# EAGLE schematic GBxCart_RW_v1.0_Schematic (EAGLE 6.4)
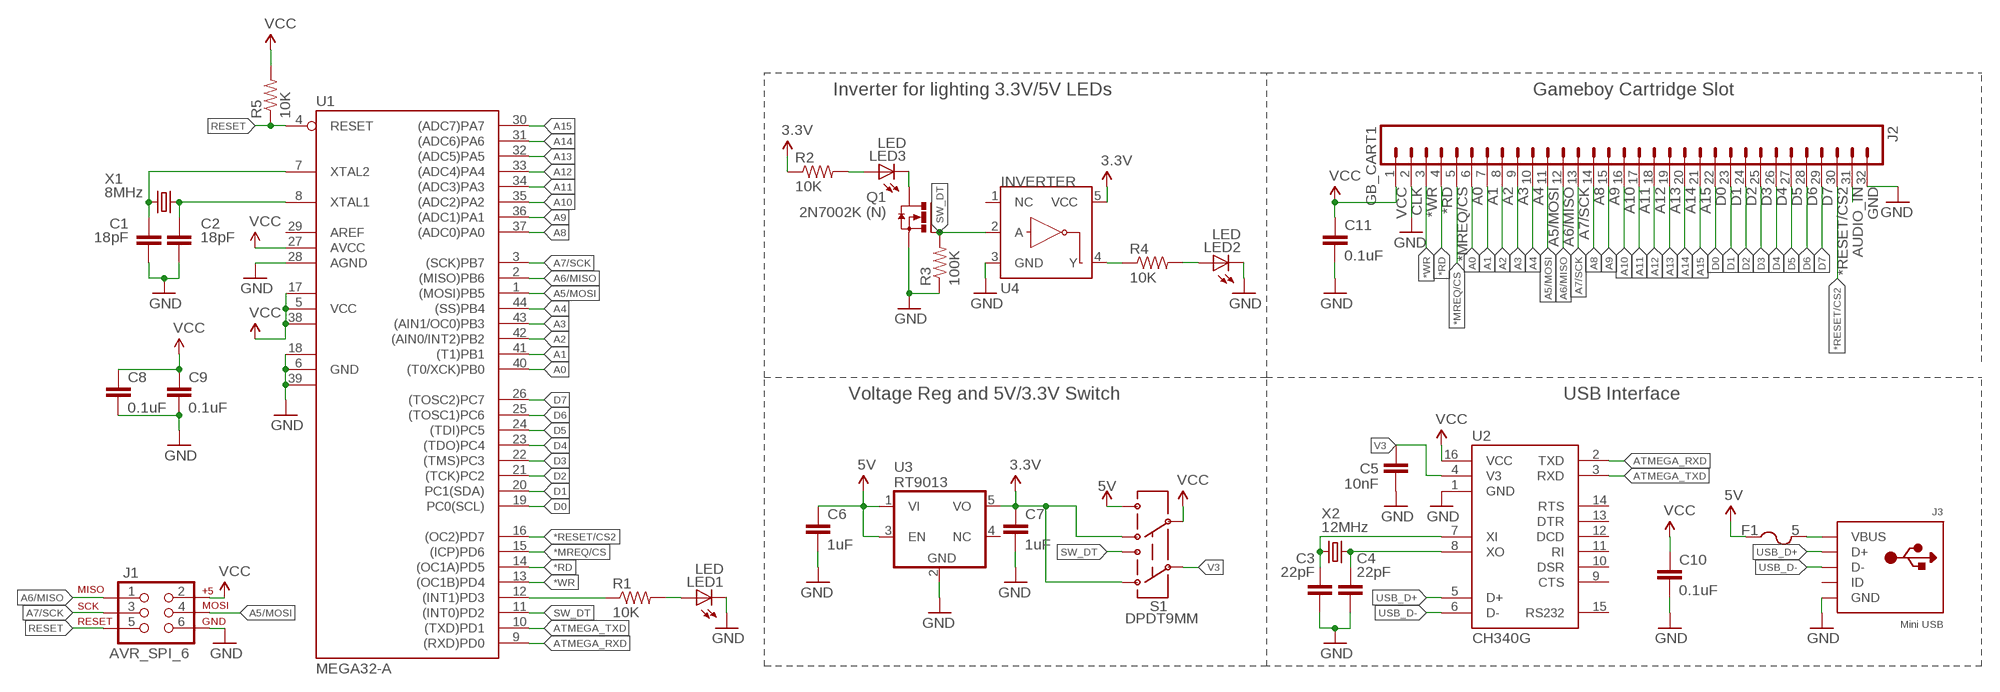
[diagram p0: schematic, sheet 1]

## Parts
C1  18pF  CAP0805  [C0805K]
C2  18pF  CAP0805  [C0805K]
C3  22pF  CAP0805  [C0805K]
C4  22pF  CAP0805  [C0805K]
C5  10nF  CAP0805  [C0805K]
C6  1uF  CAP0805  [C0805K]
C7  1uF  CAP0805  [C0805K]
C8  0.1uF  CAP0805  [C0805K]
C9  0.1uF  CAP0805  [C0805K]
C10  0.1uF  CAP0805  [C0805K]
C11  0.1uF  CAP0805  [C0805K]
F1  5  PTCFUSE-1206  [R1206]
J1  AVR_SPI_6  AVR_SPI_PRG_6  [2X3_2]
J2  GB_CART1  [GB_CART_1]
J3  Mini USB  USBMINIB  [USB-MINIB]
LED1  LED  LEDCHIP-LED0805  [CHIP-LED0805]
LED2  LED  LEDCHIP-LED0805  [CHIP-LED0805]
LED3  LED  LEDCHIP-LED0805  [CHIP-LED0805]
Q1  2N7002K (N)  2N7002K_(N)SOT-23  [SOT-23]
R1  10K  R-US_R0805_2  [R0805_2]
R2  10K  R-US_R0805_2  [R0805_2]
R3  100K  R-US_R0805_2  [R0805_2]
R4  10K  R-US_R0805_2  [R0805_2]
R5  10K  R-US_R0805_2  [R0805_2]
S1  DPDT9MM  SWITCH-DPDT9MM-DIP  [DPDT-3]
U1  MEGA32-A  [TQFP44]
U2  CH340G  [SO16]
U3  RT9013  [SOT23-5L]
U4  INVERTER  [SOT23-5]
X1  8MHz  CRYSTALHC49U-V  [HC49U-V]
X2  12MHz  CRYSTALHC49U-V  [HC49U-V]

## Nets
3.3V: C7.1 R2.1 S1.1 S1.4 U3.5(VO) U4.5(VCC)
5V: C6.1 F1.1 S1.6 U3.1(VI) U3.3(EN)
*MREQ/CS: J2.5 U1.15((ICP)PD6)
*RD: J2.4 U1.14((OC1A)PD5)
*RESET/CS2: J2.30 U1.16((OC2)PD7)
*WR: J2.3 U1.13((OC1B)PD4)
A0: J2.6 U1.40((T0/XCK)PB0)
A1: J2.7 U1.41((T1)PB1)
A2: J2.8 U1.42((AIN0/INT2)PB2)
A3: J2.9 U1.43((AIN1/OC0)PB3)
A4: J2.10 U1.44((SS)PB4)
A5/MOSI: J1.4 J2.11 U1.1((MOSI)PB5)
A6/MISO: J1.1 J2.12 U1.2((MISO)PB6)
A7/SCK: J1.3 J2.13 U1.3((SCK)PB7)
A8: J2.14 U1.37((ADC0)PA0)
A9: J2.15 U1.36((ADC1)PA1)
A10: J2.16 U1.35((ADC2)PA2)
A11: J2.17 U1.34((ADC3)PA3)
A12: J2.18 U1.33((ADC4)PA4)
A13: J2.19 U1.32((ADC5)PA5)
A14: J2.20 U1.31((ADC6)PA6)
A15: J2.21 U1.30((ADC7)PA7)
ATMEGA_RXD: U1.9((RXD)PD0) U2.2(TXD)
ATMEGA_TXD: U1.10((TXD)PD1) U2.3(RXD)
AUDIO_IN: J2.31
D0: J2.22 U1.19(PC0(SCL))
D1: J2.23 U1.20(PC1(SDA))
D2: J2.24 U1.21((TCK)PC2)
D3: J2.25 U1.22((TMS)PC3)
D4: J2.26 U1.23((TDO)PC4)
D5: J2.27 U1.24((TDI)PC5)
D6: J2.28 U1.25((TOSC1)PC6)
D7: J2.29 U1.26((TOSC2)PC7)
GND: C1.2 C2.2 C3.2 C4.2 C5.2 C6.2 C7.2 C8.2 C9.2 C10.2 C11.2 J1.6 J2.2 J2.32 J3.GND LED1.C LED2.C Q1.2(S) R3.1 U1.6(GND) U1.18(GND1) U1.28(AGND) U1.39(GND2) U2.1(GND) U3.2(GND) U4.3(GND)
N$1: R1.1 U1.12((INT1)PD3)
N$2: LED2.A R4.2
N$4: R4.1 U4.4(Y)
N$5: LED3.A R2.2
N$6: LED3.C Q1.3(D)
N$7: F1.2 J3.VBUS
N$18: LED1.A R1.2
RESET: J1.5 R5.1 U1.4(RESET)
SW_DT: Q1.1(G) R3.2 S1.3 U1.11((INT0)PD2) U4.2(A)
USB_D+: J3.D+ U2.5(D+)
USB_D-: J3.D- U2.6(D-)
V3: C5.1 S1.2 U2.4(V3)
VCC: C8.1 C9.1 C10.1 C11.1 J1.2 J2.1 R5.2 S1.5 U1.5(VCC) U1.17(VCC1) U1.27(AVCC) U1.38(VCC2) U2.16(VCC)
XTAL3: C3.1 U2.7(XI) X2.2
XTAL4: C4.1 U2.8(XO) X2.1
XTAL5: C1.1 U1.7(XTAL2) X1.2
XTAL6: C2.1 U1.8(XTAL1) X1.1
Unconnected: J3.ID U2.9(CTS) U2.10(DSR) U2.11(RI) U2.12(DCD) U2.13(DTR) U2.14(RTS) U2.15(RS232) U3.4(NC) U4.1(NC)

## Notes on the sheet
- Inverter for lighting 3.3V/5V LEDs | Gameboy Cartridge Slot
- VCC | CLK
- Voltage Reg and 5V/3.3V Switch | USB Interface

## Power pins joined to a net without a drawn wire
AREF: U1.29(AREF)

## Library data of the parts
C1-C11 = adafruit:CAP
F1 = adafruit:PTCFUSE: PTC fuses, resettable thermistors
J1 = SparkFun:AVR_SPI_PRG_6: AVR ISP 6 Pin This is the reduced ISP connector for AVR programming. Common on Arduino. This footprint will take up less PCB space and can be used with a 10-pin to 6-pin adapter such as SKU: BOB-08508
J2 = alex:GB_CART
J3 = adafruit:USB: USB Connectors USBMINIB - Surface Mount Female Mini-B USB Connector 4UConnector: 06564 By microbuilder.eu Thru-hole RA Female Mini-B USB Connector 4UConnector: 18732 By ladyada.net
LED1-LED3 = adafruit:LED: LED OSRAM: - CHIPLED LG R971, LG N971, LY N971, LG Q971, LY Q971, LO R971, LY R971 LH N974, LH R974 LS Q976, LO Q976, LY Q976 LO Q996 - Hyper CHIPLED LW Q18S LB Q993, LB Q99A, LB R99A - SideLED LS A670, LO A670, LY A670, LG A670, LP A670 LB A673, LV A673, LT A673, LW A673 LH A674 LY A675 LS A676, LA A676, LO A676, LY A676, LW A676 LS A679, LY A679, LG A679 - Hyper Micro SIDELED® LS Y876, LA Y876, LO Y876, LY Y876 LT Y87S - SmartLED LW L88C, LW L88S LB L89C, LB L89S, LG L890 LS L89K, LO L89K, LY L89K LS L896, LA L896, LO L896, LY L896 - TOPLED LS T670, LO T670, LY T670, LG T670, LP T670 LSG T670, LSP T670, LSY T670, LOP T670, LYG T670 LG T671, LOG T671, LSG T671 LB T673, LV T673, LT T673, LW T673 LH T674 LS T676, LA T676, LO T676, LY T676, LB T676, LH T676, LSB T676, LW T676 LB T67C, LV T67C, LT T67C, LS T67K, LO T67K, LY T67K, LW E67C LS E67B, LA E67B, LO E67B, LY E67B, LB E67C, LV E67C, LT E67C LW T67C LS T679, LY T679, LG T679 LS T770, LO T770, LY T770, LG T770, LP T770 LB T773, LV T773, LT T773, LW T773 LH T774 LS E675, LA E675, LY E675, LS T675 LS T776, LA T776, LO T776, LY T776, LB T776 LHGB T686 LT T68C, LB T68C - Hyper Mini TOPLED® LB M676 - Mini TOPLED Santana® LG M470 LS M47K, LO M47K, LY M47K Source: http://www.osram.convergy.de/
Q1 = alex:2N7002K_(N)
R1-R5 = adafruit:R-US_: RESISTOR, American symbol
S1 = SparkFun:SWITCH-DPDT: DPDT Version of the COM-00597
U1 = avr-5:MEGA32: MICROCONTROLLER 32 Kbytes FLASH 2 Kbytes SRAM 1 Kbytes EEPROM USART 8-channel 10 bit ADC
U2 = alex:CH340G
U3 = adafruit:RT9013
U4 = SparkFun:INVERTER: Single inverter, SOT23-5
X1 X2 = crystal:CRYSTAL: CRYSTAL